# EAGLE design PLACA_01 (EAGLE 9.6.2)
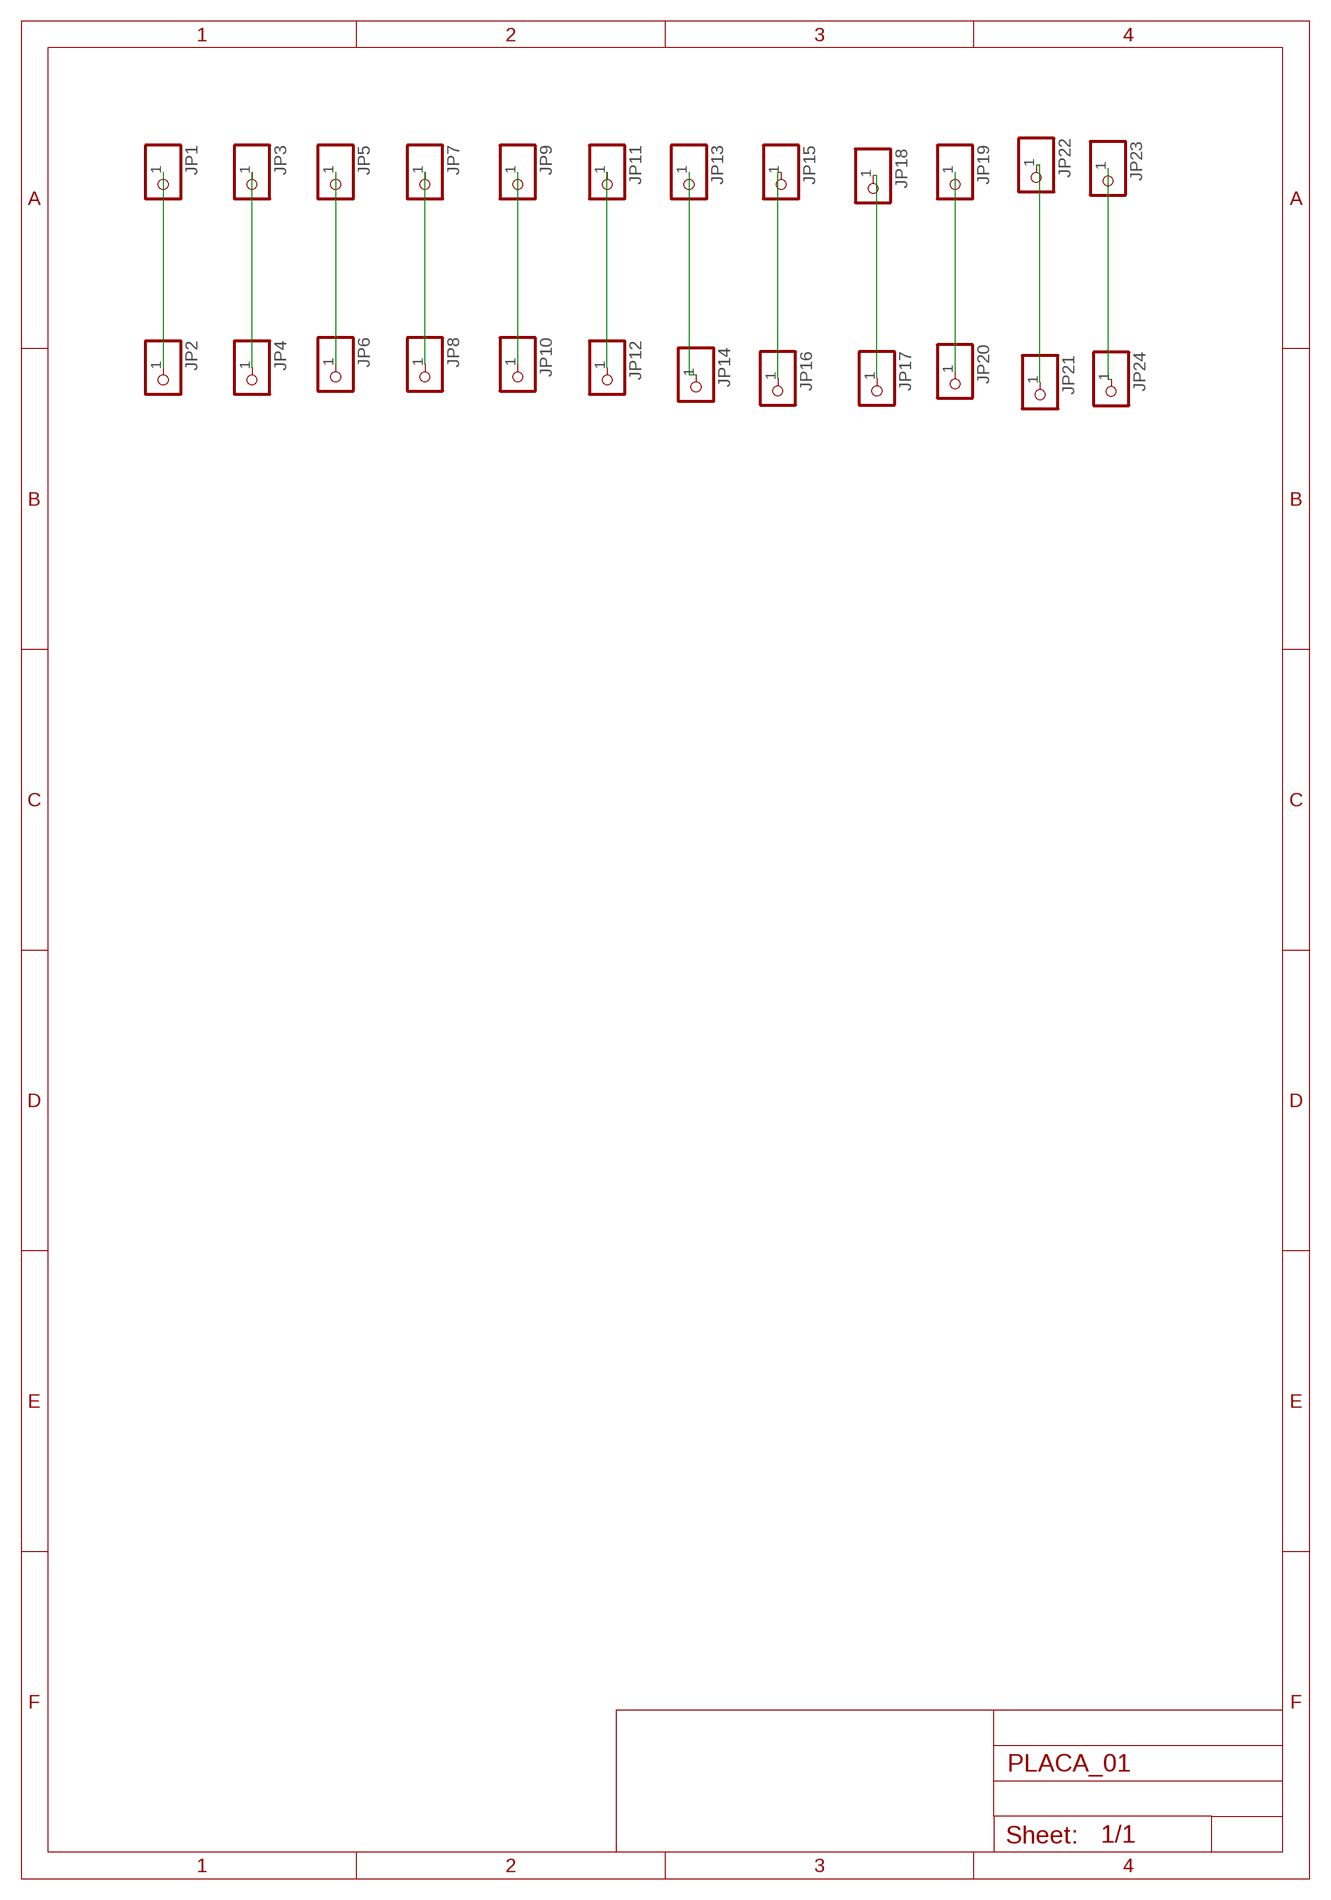
[diagram p0: schematic, sheet 1]

## Parts
JP1  PINHD-1X1  [1X01]
JP2  PINHD-1X1  [1X01]
JP3  PINHD-1X1  [1X01]
JP4  PINHD-1X1  [1X01]
JP5  PINHD-1X1  [1X01]
JP6  PINHD-1X1  [1X01]
JP7  PINHD-1X1  [1X01]
JP8  PINHD-1X1  [1X01]
JP9  PINHD-1X1  [1X01]
JP10  PINHD-1X1  [1X01]
JP11  PINHD-1X1  [1X01]
JP12  PINHD-1X1  [1X01]
JP13  PINHD-1X1  [1X01]
JP14  PINHD-1X1  [1X01]
JP15  PINHD-1X1  [1X01]
JP16  PINHD-1X1  [1X01]
JP17  PINHD-1X1  [1X01]
JP18  PINHD-1X1  [1X01]
JP19  PINHD-1X1  [1X01]
JP20  PINHD-1X1  [1X01]
JP21  PINHD-1X1  [1X01]
JP22  PINHD-1X1  [1X01]
JP23  PINHD-1X1  [1X01]
JP24  PINHD-1X1  [1X01]

## Nets
N$1: JP1.1 JP2.1
N$2: JP3.1 JP4.1
N$3: JP5.1 JP6.1
N$4: JP7.1 JP8.1
N$5: JP9.1 JP10.1
N$6: JP11.1 JP12.1
N$7: JP13.1 JP14.1
N$8: JP15.1 JP16.1
N$9: JP17.1 JP18.1
N$10: JP19.1 JP20.1
N$11: JP21.1 JP22.1
N$12: JP23.1 JP24.1

## Library data of the parts
JP1-JP24 = pinhead:PINHD-1X1: PIN HEADER

## Board
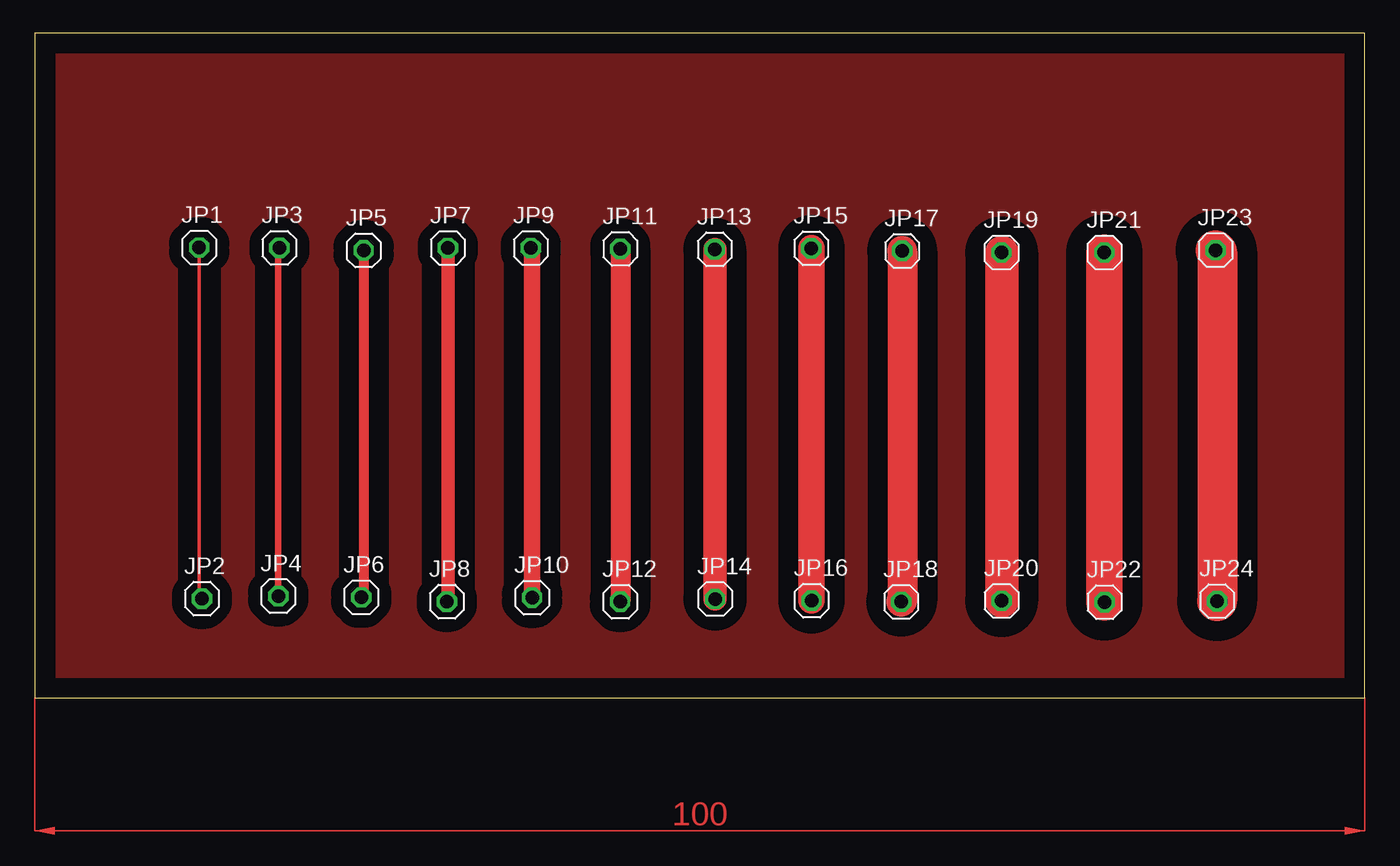
[diagram p1: board, top side]

Size 100 x 50 mm. Coordinates in mm from the lower left corner, seen from the top.
Outline: 0,0 100,0 100,50 0,50 0,0
Copper layers (1*16): Top 0.035mm / dielectric 1.5mm / Bottom 0.035mm
Design rules "default": minimum track width 6mil, minimum drill 0.35mm, track to track 6mil, track to pad 6mil, pad to pad 6mil, via to via 6mil, smd to smd 6mil, copper to edge 40mil, drill to drill 6mil, minimum pad ring 10mil, minimum via ring 8mil, stop-mask expansion 4mil, vias tented up to drill 0mil, thermal gap 10mil

### Footprints (pad centres in the part's own frame; a part is rotated, then mirrored left to right if it is on the bottom)
1X01 = drill 1.016 octagon: 1 0,0

### Placement (x,y rotation side)
JP1  12.35,33.88 0 top
JP2  12.56,7.46 0 top
JP3  18.38,33.86 0 top
JP4  18.3,7.66 0 top
JP5  24.72,33.66 0 top
JP6  24.54,7.56 0 top
JP7  31.06,33.84 0 top
JP8  30.98,7.24 0 top
JP9  37.3,33.84 0 top
JP10  37.39,7.54 0 top
JP11  44.03,33.78 0 top
JP12  44.01,7.24 0 top
JP13  51.13,33.74 0 top
JP14  51.15,7.44 0 top
JP15  58.39,33.82 0 top
JP16  58.41,7.32 0 top
JP17  65.23,33.62 0 top
JP18  65.15,7.22 0 top
JP19  72.69,33.5 0 top
JP20  72.71,7.3 0 top
JP21  80.43,33.5 0 top
JP22  80.45,7.2 0 top
JP23  88.79,33.68 0 top
JP24  88.91,7.28 0 top

### Tracks (layer width: path | path; a pad name or v marks a point on that pad's centre or on a via)
1
  pour Top (isolate 1.5): 0.6,49.5 0.6,1 99,1 99,49.5
N$1
  Top 0.25: JP1.1 12.35,7.67 JP2.1
N$2
  Top 0.5: JP3.1 18.3,33.78 JP4.1
N$3
  Top 0.75: JP5.1 24.72,7.74 JP6.1
N$4
  Top 1: JP7.1 31.06,7.32 JP8.1
N$5
  Top 1.25: JP9.1 37.39,33.75 JP10.1
N$6
  Top 0.152: JP12.1 44.03,7.26
  Top 1.5: JP11.1 44.03,7.26
N$7
  Top 1.75: JP13.1 51.13,7.46 JP14.1
N$8
  Top 2: JP15.1 58.41,33.8 JP16.1
N$9
  Top 2.25: JP17.1 65.23,7.3 JP18.1
N$10
  Top 0.152: JP19.1 72.71,33.48
  Top 2.5: 72.71,33.48 JP20.1
N$11
  Top 2.75: JP21.1 80.43,7.22 JP22.1
N$12
  Top 3: JP23.1 88.91,33.56 JP24.1
(copper drawn outside any net)
  shapes: Top area x2